# EAGLE design AutoFeatherPower3 (EAGLE 9.4.0)
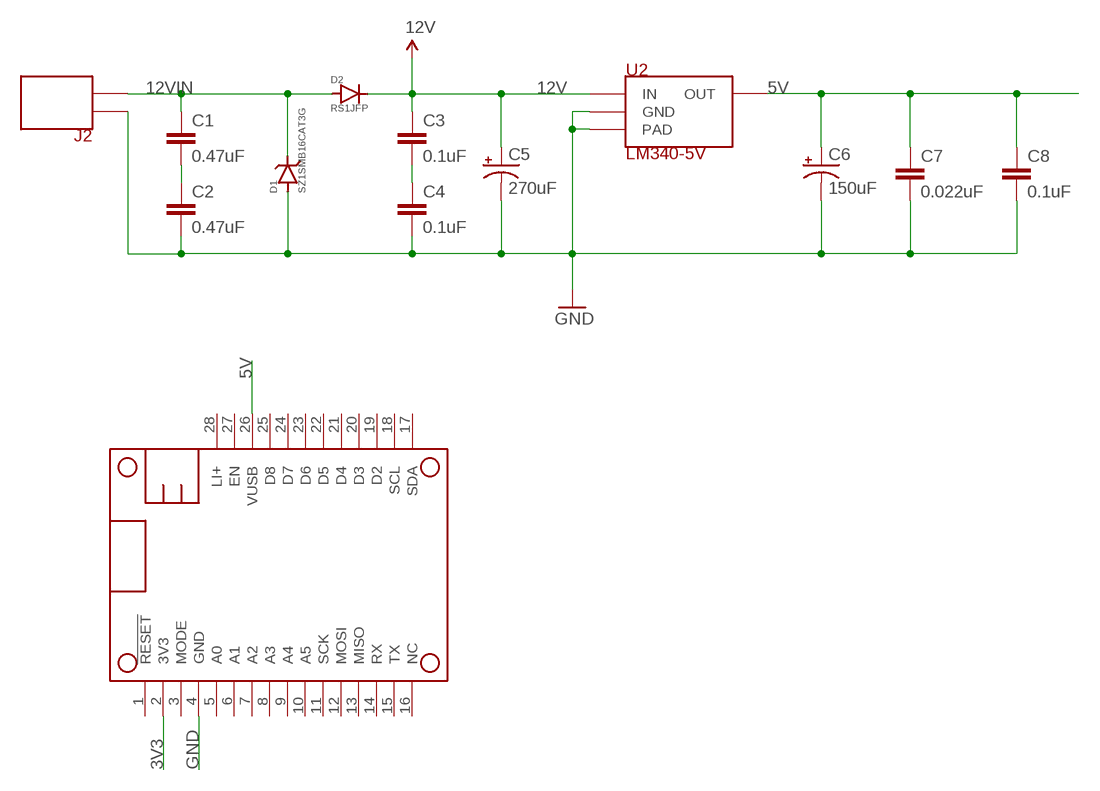
[diagram p0: schematic, sheet 1]

## Parts
C1  0.47uF  CAP-0.47UF-0805  [0805]
C2  0.47uF  CAP-0.47UF-0805  [0805]
C3  0.1uF  CAP-0.1UF-0603  [0603-CAP]
C4  0.1uF  CAP-0.1UF-0603  [0603-CAP]
C5  270uF  CAP-270UF-35V-SMD  [CAP-PANASONIC-FKS-V-F]
C6  150uF  CAP-150UF-10V-SMD  [CAP-PANASONIC-FKS-V-D]
C7  0.022uF  CAP-0.022UF-0603  [0603-CAP]
C8  0.1uF  CAP-0.1UF-0603  [0603-CAP]
D1  SZ1SMB16CAT3G  DIODE-TVS-SZ1SMB  [SZ1SMB]
D2  RS1JFP  DIODE-RS1JFP  [SOD-123HE-ON]
J2  TERMBLOCK-2X3.5MM  [TERMBLOCK-2X3.5MM]
MS1  FEATHERWING_NODIM  [FEATHERWING_NODIM]
U2  LM340-5V  LM340  [TO-263-3-TI]

## Nets
3V3: MS1.2(3V3)
5V: C6.P+(+) C7.1 C8.1 MS1.26(VUSB) U2.3(OUT)
12V: C3.1 C5.P+(+) D2.1(CATHODE) U2.1(IN)
12VIN: C1.1 D1.C(CATHODE) D2.2(ANODE) J2.2
GND: C2.2 C4.2 C5.P-(-) C6.P-(-) C7.2 C8.2 D1.A(ANODE) J2.1 MS1.4(GND) U2.2(GND) U2.PAD
N$3: C1.2 C2.1
N$4: C3.2 C4.1
Unconnected: MS1.1(!RESET) MS1.3(MODE) MS1.5(A0) MS1.6(A1) MS1.7(A2) MS1.8(A3) MS1.9(A4) MS1.10(A5) MS1.11(SCK) MS1.12(MOSI) MS1.13(MISO) MS1.14(RX) MS1.15(TX) MS1.16(NC) MS1.17(SDA) MS1.18(SCL) MS1.19(D2) MS1.20(D3) MS1.21(D4) MS1.22(D5) MS1.23(D6) MS1.24(D7) MS1.25(D8) MS1.27(EN) MS1.28(LI+)

## Library data of the parts
C1 C2 = rickk2:CAP-0.47UF-0805: Wurth Electronics Inc. 885012207076 **not ordered yet** CAP CER 0.47UF 25V X7R 0805 0.47µF ±10% 25V Ceramic Capacitor X7R 0805 (2012 Metric) https://www.digikey.com/product-detail/en/wurth-electronics-inc/885012207076/732-7670-1-ND/5454297
C3 C4 C8 = rickk2:CAP-0.1UF-0603: CAP CER 0.1UF 16V X7R 0603 https://www.digikey.com/product-detail/en/murata-electronics-north-america/GRM188R71C104KA01D/490-1532-1-ND/587771
C5 = rickk2:CAP-270UF-35V-SMD: CAP 270uF 35V SMD 8mm dia x 10.5mm height Panasonic Electronic Components EEE-FK1V271SP $0.84 CAP ALUM 270UF 20% 35V SMD 270µF 35V Aluminum Electrolytic Capacitors Radial, Can - SMD 160 mohm @ 100kHz 2000 Hrs @ 105°C https://www.digikey.com/product-detail/en/panasonic-electronic-components/EEE-FK1V271SP/P18962CT-ND/5805069 Series: FVS Type: V Size Code: F
C6 = rickk2:CAP-150UF-10V-SMD: CAP 150uF 10V SMD Panasonic Electronic Components EEE-FK1A151P $0.51 CAP ALUM 150UF 20% 10V SMD 150µF 10V Aluminum Electrolytic Capacitors Radial, Can - SMD 2000 Hrs @ 105°C https://www.digikey.com/product-detail/en/panasonic-electronic-components/EEE-FK1A151P/PCE3773CT-ND/766149 6.3mm diameter, 5.8 mm length Size code D
C7 = rickk2:CAP-0.022UF-0603: KEMET C0603C223K5RACTU $0.10 **not ordered yet** CAP CER 0.022UF (22nF) 50V X7R 0603 0.022µF ±10% 50V Ceramic Capacitor X7R 0603 (1608 Metric) https://www.digikey.com/product-detail/en/kemet/C0603C223K5RACTU/399-1280-1-ND/416056
D1 = rickk2:DIODE-TVS-SZ1SMB: Littelfuse Inc. SZ1SMB16CAT3G $0.97 **not purchased yet** TVS DIODE 16V 26V SMB 26V Clamp 23.1A Ipp Tvs Diode Surface Mount SMB https://www.digikey.com/products/en/circuit-protection/tvs-diodes/144?k=1SMB16CAT3G&k=&pkeyword=1SMB16CAT3G&sv=0&pv7=2&pv1989=0&sf=0&quantity=&ColumnSort=0&page=1&stock=1&pageSize=25 Unidirectional. Marking: LM Marking band on cathode side Device: DIODE-TVS-SZ1SMB
D2 = rickk2:DIODE-RS1JFP: Reverse voltage protection diode - not ordered yet! ON Semiconductor RS1JFP $0.44 DIODE GP 600V 1.2A SOD123HE Diode Standard 600V 1.2A Surface Mount SOD-123HE https://www.digikey.com/product-detail/en/on-semiconductor/RS1JFP/RS1JFPCT-ND/5722970 Used in Ford open power supply 1=Cathode=Large Pad=side with band 2=Anode=Small Pad
J2 = rickk2:TERMBLOCK-2X3.5MM
MS1 = Particle-Mesh:FEATHERWING
U2 = rickk2:LM340: Texas Instruments LM340SX-5.0/NOPB $1.58 **not purchased yet** IC REG LIN 5V 1A DDPAK/TO263-3 Linear Voltage Regulator IC Positive Fixed 1 Output 1.5A DDPAK/TO-263-3 https://www.digikey.com/products/en?keywords=LM340SX-5.0%2FNOPBCT-ND

## Board
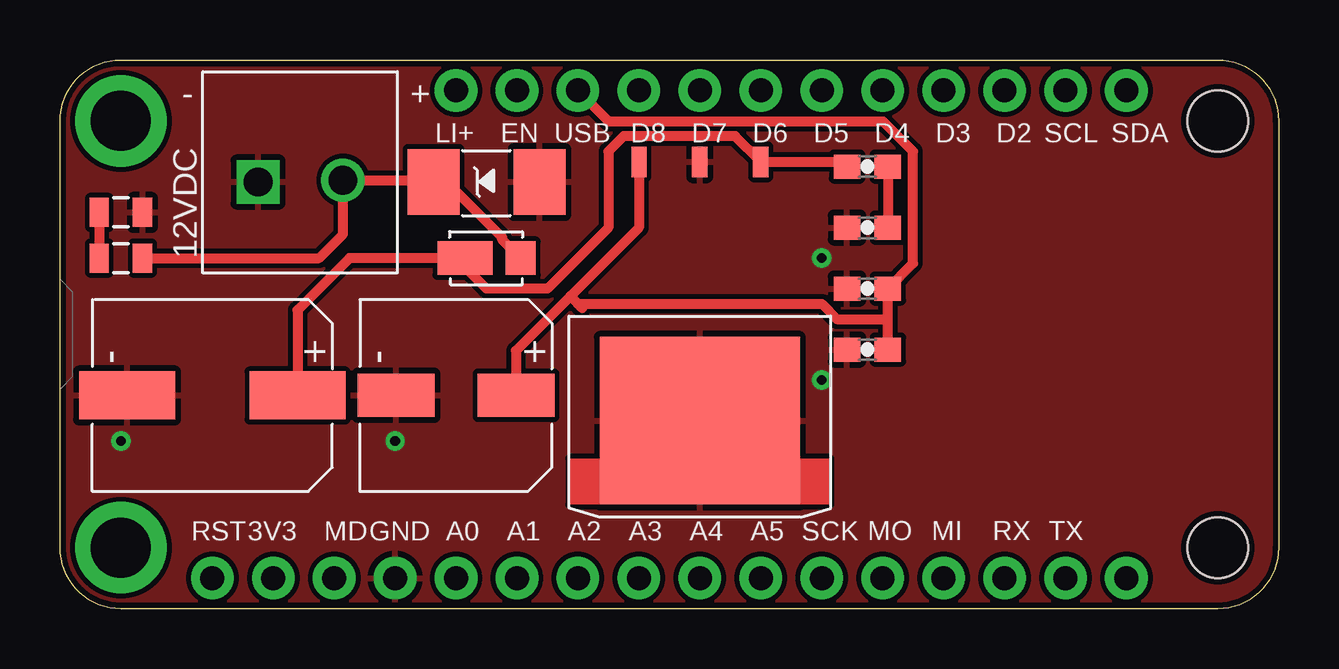
[diagram p1: board, top side]
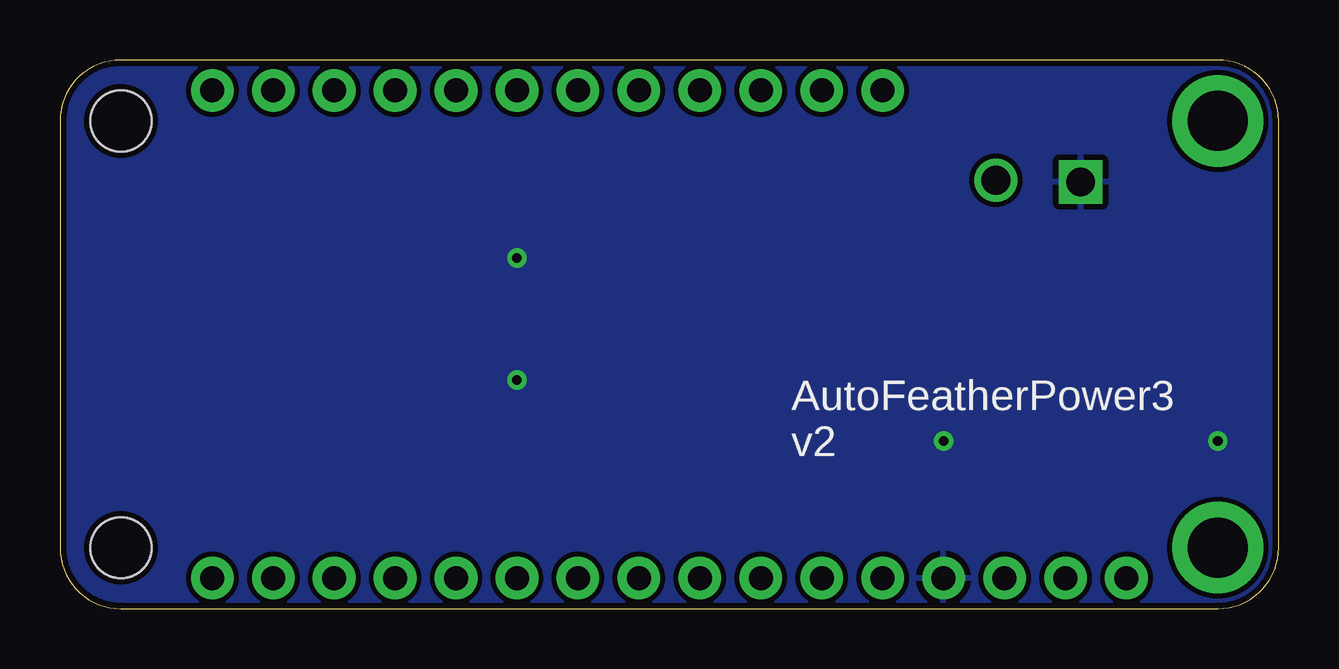
[diagram p2: board, bottom side, seen from below]

Size 50.8 x 22.86 mm. Coordinates in mm from the lower left corner, seen from the top.
Outline: 2.54,22.86 48.26,22.86 arc-90 50.8,20.32 50.8,2.54 arc-90 48.26,0 2.54,0 arc-90 0,2.54 0,20.32 arc-90 2.54,22.86
Copper layers (1*16): Top 0.035mm / dielectric 1.5mm / Bottom 0.035mm
Design rules "adafruit": minimum track width 8mil, minimum drill 15.5mil, track to track 8mil, track to pad 8mil, pad to pad 8mil, via to via 8mil, smd to smd 8mil, copper to edge 10mil, drill to drill 8mil, minimum pad ring 10mil, minimum via ring 8mil, stop-mask expansion 2mil, vias tented up to drill 20mil, thermal gap 10mil

### Footprints (pad centres in the part's own frame; a part is rotated, then mirrored left to right if it is on the bottom)
0805 = smd 0.8 x 1.2: 1 -0.9,0; 2 0.9,0
0603-CAP = smd 1.1 x 1: 1 -0.85,0; 2 0.85,0
CAP-PANASONIC-FKS-V-F = smd 2 x 4: P+ 0,-3.55; P- 0,3.55
CAP-PANASONIC-FKS-V-D = smd 1.8 x 3.2: P+ 0,-2.5; P- 0,2.5
SZ1SMB = smd 2.159 x 2.743: A 2.21,0; C -2.21,0
SOD-123HE-ON = smd 2.3 x 1.4: 1 -0.9,0 | smd 1.25 x 1.4: 2 1.425,0
TERMBLOCK-2X3.5MM = drill 1.2 square: 1 0,0 | drill 1.2: 2 3.54,0.07
FEATHERWING_NODIM = drill 1 pad 1.778: 1 6.35,1.27; 2 8.89,1.27; 3 11.43,1.27; 4 13.97,1.27; 5 16.51,1.27; 6 19.05,1.27; 7 21.59,1.27; 8 24.13,1.27; 9 26.67,1.27; 10 29.21,1.27; 11 31.75,1.27; 12 34.29,1.27; 13 36.83,1.27; 14 39.37,1.27; 15 41.91,1.27; 16 44.45,1.27; 17 44.45,21.59; 18 41.91,21.59; 19 39.37,21.59; 20 36.83,21.59; 21 34.29,21.59; 22 31.75,21.59; 23 29.21,21.59; 24 26.67,21.59; 25 24.13,21.59; 26 21.59,21.59; 27 19.05,21.59; 28 16.51,21.59 | drill 2.5 pad 3.81: P$1 2.54,20.32; P$2 2.54,2.54 | hole 2.54: 48.26,20.32; 48.26,2.54
TO-263-3-TI = smd 1.27 x 0.635: 1 7.188,-2.54; 2 7.188,0; 3 7.188,2.54 | smd 6.985 x 8.331: PAD -3.594,0

### Placement (x,y rotation side)
C1  2.54,14.61 180 top
C2  2.54,16.51 0 top
C3  33.66,18.41 0 top
C4  33.66,15.88 180 top
C5  6.35,8.89 90 top
C6  16.51,8.89 90 top
C7  33.66,13.34 180 top
C8  33.66,10.79 180 top
D1  17.78,17.78 0 top
D2  17.78,14.61 0 top
J2  8.26,17.78 0 top
MS1  0,0 0 top
U2  26.67,11.43 90 top

### Tracks (layer width: path | path; a pad name or v marks a point on that pad's centre or on a via)
5V
  Top 0.406: 34.51,13.62 C7.1 | C6.P+ 19.01,10.76 21.27,13.02 | U2.3 24.13,15.88 21.27,13.02 | C8.1 34.51,12.06 | 34.51,12.06 C7.1 | 21.77,12.53 21.59,12.7 | 21.59,12.7 21.27,13.02 | MS1.26 22.89,20.3 34.31,20.3 35.56,19.05 35.56,14.39 C7.1 | 34.51,12.06 32.38,12.06 31.75,12.7 21.59,12.7
12V
  Top 0.406: C5.P+ 9.9,12.44 12.06,14.61 D2.1 16.88,14.23 17.78,13.34 20.32,13.34 22.86,15.88 22.86,19.05 23.5,19.68 28.14,19.68 U2.1 32.6,18.62 C3.1
12VIN
  Top 0.406: C1.1 10.79,14.61 11.79,15.61 J2.2 15.24,17.85 15.5,17.85 | 15.5,17.85 D1.C | D2.2 18.44,15.37 18.44,15.47 16.06,17.85 15.5,17.85
GND  (via drill 0.4)
  other vias: 31.75,14.61 31.75,9.53 13.97,6.99 2.54,6.99
  pour Top: 0,0 0,25.4 53.34,25.4 53.34,0
  pour Bottom: 0,0 0,27.94 50.8,27.94 50.8,0
N$3
  Top 0.406: C2.1 C1.2
N$4
  Top 0.406: C3.2 C4.1

### Text on the board
tPlace: - | + | LI+ | EN | USB | D8 | D7 | D6 | D5 | D4 | D3 | D2 | SCL | SDA | 12VDC | RST | 3V3 | MD | GND | A0 | A1 | A2 | A3 | A4 | A5 | SCK | MO | MI | RX | TX
bPlace: AutoFeatherPower3 / v2